# EAGLE design teenseyBreakoutFin (EAGLE 8.3.2)
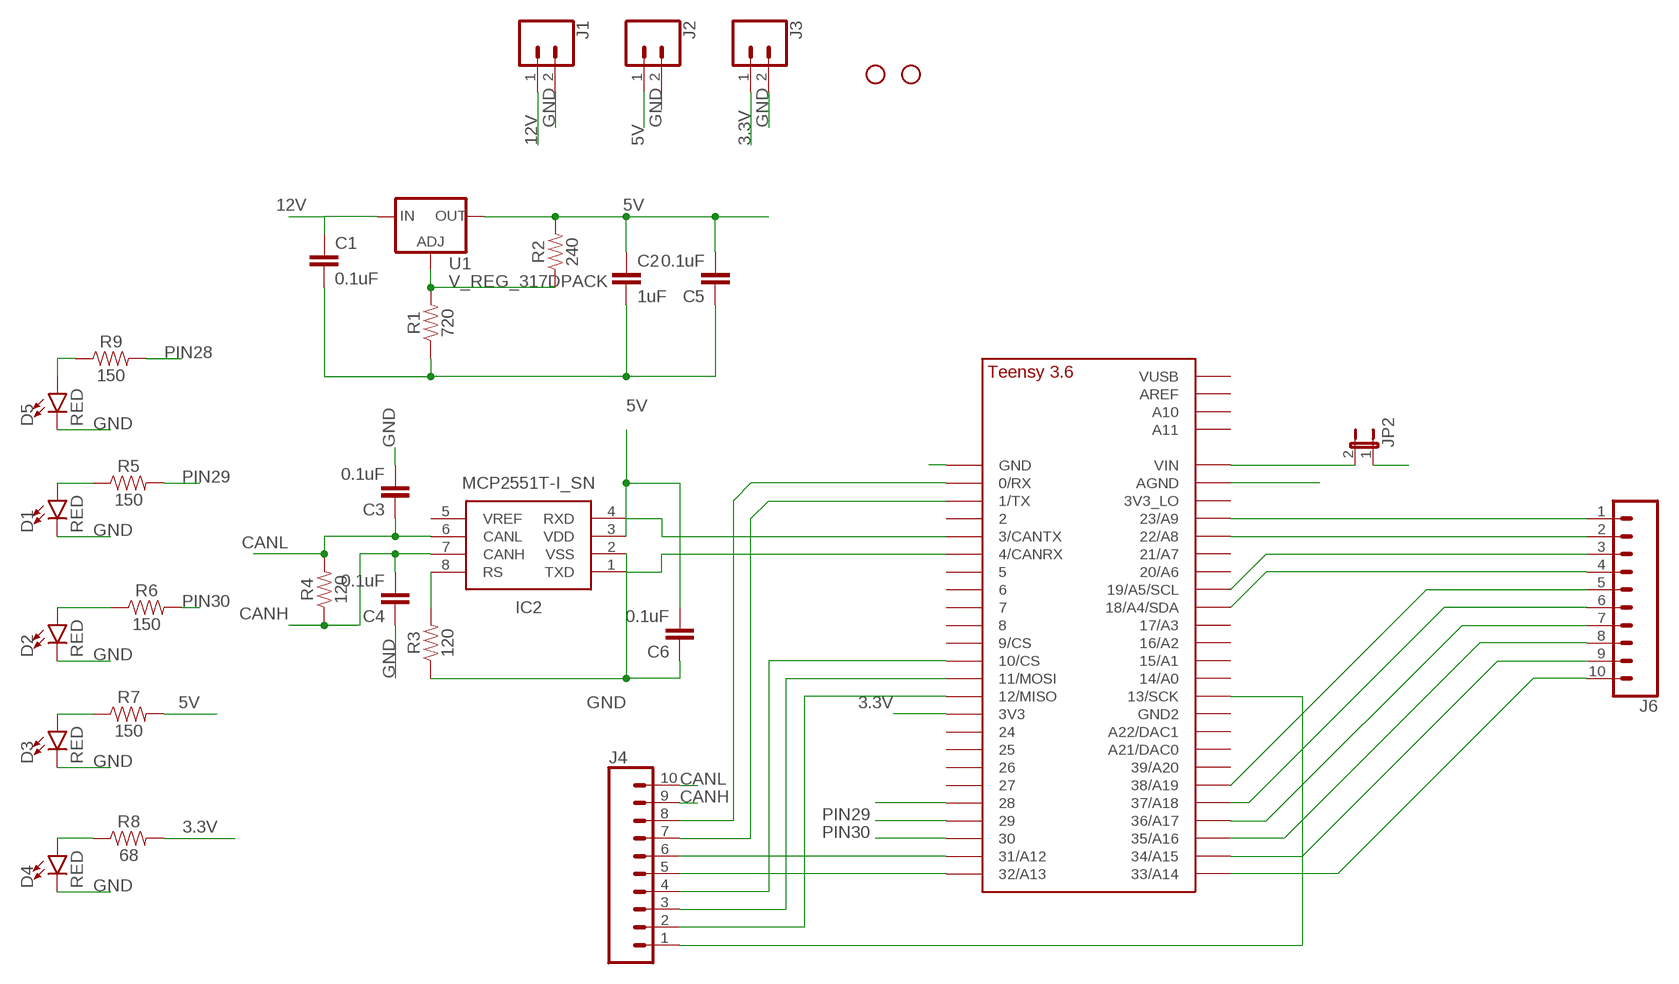
[diagram p0: schematic, sheet 1]

## Parts
C1  0.1uF  0.1UF-0402-16V-10%  [0402]
C2  1uF  0.22UF-0603-25V-10%  [0603]
C3  0.1uF  0.1UF-0603-25V-(+80/-20%)  [0603]
C4  0.1uF  0.1UF-0603-25V-(+80/-20%)  [0603]
C5  0.1uF  0.1UF-0603-25V-(+80/-20%)  [0603]
C6  0.1uF  0.1UF-0603-25V-(+80/-20%)  [0603]
D1  RED  LED-RED0603  [LED-0603]
D2  RED  LED-RED0603  [LED-0603]
D3  RED  LED-RED0603  [LED-0603]
D4  RED  LED-RED0603  [LED-0603]
D5  RED  LED-RED0603  [LED-0603]
H2  STAND-OFF  [STAND-OFF]
IC2  MCP2551T-I_SN  [SOIC127P600X175-8N]
J1  CONN_023.5MM_LOCK  [SCREWTERMINAL-3.5MM-2_LOCK]
J2  CONN_023.5MM_LOCK  [SCREWTERMINAL-3.5MM-2_LOCK]
J3  CONN_023.5MM_LOCK  [SCREWTERMINAL-3.5MM-2_LOCK]
J4  CONN_10LOCK  [1X10_LOCK]
J6  CONN_10LOCK  [1X10_LOCK]
JP2  JP1E  [JP1]
R1  720  1.20KOHM-0603-1/10W-1%  [0603]
R2  240  1.20KOHM-0603-1/10W-1%  [0603]
R3  120  1.2MOHM-0603-1/10W-1%  [0603]
R4  120  10KOHM-HORIZ-1/4W-1%  [AXIAL-0.3]
R5  150  0.27OHM-0603-1/10W-1%  [0603]
R6  150  0.27OHM-0603-1/10W-1%  [0603]
R7  150  0.27OHM-0603-1/10W-1%  [0603]
R8  68  0.27OHM-0603-1/10W-1%  [0603]
R9  150  0.27OHM-0603-1/10W-1%  [0603]
SCREW_HOLE  STAND-OFF  [STAND-OFF]
U1  V_REG_317DPACK  [V-REG_DPACK]
U$1  TEENSY_3.5/3.6_BASIC  [TEENSY_3.5/3.6_BASIC]

## Nets
3.3V: J3.1 R8.2 U$1.3V3
5V: C2.1 C5.2 C6.2 IC2.3(VDD) J2.1 JP2.1 R2.2 R7.2 U1.4(OUT)
12V: C1.1 J1.1 U1.3(IN)
CANH: C4.2 IC2.7(CANH) J4.9 R4.P$1
CANL: C3.1 IC2.6(CANL) J4.10 R4.P$2
GND: C1.2 C2.2 C3.2 C4.1 C5.1 C6.1 D1.C D2.C D3.C D4.C D5.C IC2.2(VSS) J1.2 J2.2 J3.2 R1.1 R3.1 U$1.AGND U$1.GND
N$1: IC2.1(TXD) U$1.4/CANRX
N$2: J4.8 U$1.0/RX
N$3: R1.2 R2.1 U1.1(ADJ)
N$4: J4.7 U$1.1/TX
N$5: J4.6 U$1.31/A12
N$6: J4.5 U$1.32/A13
N$7: J4.4 U$1.10/CS
N$8: IC2.4(RXD) U$1.3/CANTX
N$9: J4.1 U$1.13/SCK
N$10: IC2.8(RS) R3.2
N$11: J4.3 U$1.11/MOSI
N$12: J4.2 U$1.12/MISO
N$13: J6.1 U$1.23/A9
N$14: J6.2 U$1.22/A8
N$15: J6.3 U$1.19/A5/SCL
N$16: J6.4 U$1.18/A4/SDA
N$17: J6.5 U$1.38/A19
N$18: J6.6 U$1.37/A18
N$19: J6.7 U$1.36/A17
N$20: J6.8 U$1.35/A16
N$21: J6.9 U$1.34/A15
N$22: J6.10 U$1.33/A14
N$24: D1.A R5.1
N$25: D5.A R9.1
N$26: D2.A R6.1
N$28: D3.A R7.1
N$30: D4.A R8.1
PIN28: R9.2 U$1.28
PIN29: R5.2 U$1.29
PIN30: R6.2 U$1.30
VIN: JP2.2 U$1.VIN
Unconnected: IC2.5(VREF) U$1.2 U$1.3V3_LO U$1.5 U$1.6 U$1.7 U$1.8 U$1.9/CS U$1.14/A0 U$1.15/A1 U$1.16/A2 U$1.17/A3 U$1.20/A6 U$1.21/A7 U$1.21/DAC0(A21/DAC0) U$1.24 U$1.25 U$1.26 U$1.27 U$1.39/A20 U$1.A10 U$1.A11 U$1.A22/DAC1 U$1.AREF U$1.GND2 U$1.VUSB

## Library data of the parts
C1 = SparkFun-Capacitors:0.1UF: 0.1µF ceramic capacitors A capacitor is a passive two-terminal electrical component used to store electrical energy temporarily in an electric field.; PROD_ID: CAP-12416
C2 = SparkFun-Capacitors:0.22UF: 0.22µF ceramic capacitors A capacitor is a passive two-terminal electrical component used to store electrical energy temporarily in an electric field.; PROD_ID: CAP-07822; VALUE: 0.22uF
C3-C6 = SparkFun-Capacitors:0.1UF: 0.1µF ceramic capacitors A capacitor is a passive two-terminal electrical component used to store electrical energy temporarily in an electric field.; PROD_ID: CAP-00810
D1-D5 = SparkFun-LED:LED-RED: Red SMD LED Used in manufacturing of most products at SparkFun Packages: 0603 - SMD 0603 package [Product Link] <http://docs.avagotech.com/docs/AV02-0551EN> 0603 SMART - SMD 0603 SMART package ( more efficient and expensive)[Product Link] <http://www.osram-os.com/Graphics/XPic2/00077099_0.pdf> 1206 - SMD1206 package [Product Link] <https://www.sparkfun.com/datasheets/DevTools/LilyPad/Q150OVS4.pdff> SparkFun Products: Pro Mini 328 -5V <https://www.sparkfun.com/products/821> RedBoard <https://www.sparkfun.com/products/12757> IOIO-OTG <https://www.sparkfun.com/products/13613>; PROD_ID: DIO-00819
H2 SCREW_HOLE = SparkFun-Hardware:STAND-OFF: Stand Off Drill holes for mechanically mounting via screws, standoffs, etc. Note: Use the keepout ring to avoid running the screw head into surrounding components. Variant Overviews STAND-OFF - Mechanical footprint for a #4 phillips button head screw. STAND-OFF-TIGHT - Mechanical footprint for a #4 phillips button head screw, Example SparkFun Products Screw - Phillips Head (1/4", 4-40, 10 pack) <https://www.sparkfun.com/products/10453> (PRT-10453) Screw - Phillips Head (1/2", 4-40, 10 pack) <https://www.sparkfun.com/products/10452> (PRT-10452) Screw - Phillips Head (3/4", 4-40, 10 pack) <https://www.sparkfun.com/products/10451> (PRT-10451) Screw - Phillips Head (1", 4-40, 10 pack) <https://www.sparkfun.com/products/10450> (PRT-10450)
IC2 = MCP2551T-I_SN:MCP2551T-I_SN: CAN Interface IC Hi Spd CAN Transceiv <https://componentsearchengine.com/Images/3/MCP2551T-I_SN.jpg> Source: Datasheet <http://docs-europe.electrocomponents.com/webdocs/1324/0900766b8132487b.pdf>; DESCRIPTION: CAN Interface IC Hi Spd CAN Transceiv; HEIGHT: 1.75mm; MANUFACTURER_NAME: Microchip; MANUFACTURER_PART_NUMBER: MCP2551T-I/SN; RS_PART_NUMBER: 8237897P; SUPPLIER_NAME: RS
J1-J3 = SparkFun-Connectors:CONN_02: Multi connection point. Often used as Generic Header-pin footprint for 0.1 inch spaced/style header connections On any of the 0.1 inch spaced packages, you can populate with these: Break Away Headers - Straight <https://www.sparkfun.com/products/116> (PRT-00116) Break Away Male Headers - Right Angle <https://www.sparkfun.com/products/553> (PRT-00553) Female Headers <https://www.sparkfun.com/products/115> (PRT-00115) Break Away Headers - Machine Pin <https://www.sparkfun.com/products/117> (PRT-00117) Break Away Female Headers - Swiss Machine Pin <https://www.sparkfun.com/products/743> (PRT-00743) For SCREWTERMINALS and SPRING TERMINALS visit here: Screw Terimnals on SparkFun.com <https://www.sparkfun.com/search/results?term=Screw+Terminals> (5mm/3.5mm/2.54mm spacing) This device is also useful as a general connection point to wire up your design to another part of your project. Our various solder wires solder well into these plated through hole pads. Hook-Up Wire - Assortment (Stranded, 22 AWG) <https://www.sparkfun.com/products/11375> (PRT-11375) Hook-Up Wire - Assortment (Solid Core, 22 AWG) <https://www.sparkfun.com/products/11367> (PRT-11367) View the entire wire category on our website here <https://www.sparkfun.com/categories/141> Special notes: Molex polarized connector foot print use with: PRT-08233 with associated crimp pins and housings. 2.54_SCREWTERM for use with PRT-10571. 3.5mm Screw Terminal footprints for PRT-08084 5mm Screw Terminal footprints for use with PRT-08432; PROD_ID: CONN-08399
J4 J6 = SparkFun-Connectors:CONN_10: Multi connection point. Often used as Generic Header-pin footprint for 0.1 inch spaced/style header connections On any of the 0.1 inch spaced packages, you can populate with these: Break Away Headers - Straight <https://www.sparkfun.com/products/116> (PRT-00116) Break Away Male Headers - Right Angle <https://www.sparkfun.com/products/553> (PRT-00553) Female Headers <https://www.sparkfun.com/products/115> (PRT-00115) Break Away Headers - Machine Pin <https://www.sparkfun.com/products/117> (PRT-00117) Break Away Female Headers - Swiss Machine Pin <https://www.sparkfun.com/products/743> (PRT-00743) Arduino Stackable Header - 10 Pin <https://www.sparkfun.com/products/11376> (PRT-11376) For SCREWTERMINALS and SPRING TERMINALS visit here: Screw Terimnals on SparkFun.com <https://www.sparkfun.com/search/results?term=Screw+Terminals> (5mm/3.5mm/2.54mm spacing) This device is also useful as a general connection point to wire up your design to another part of your project. Our various solder wires solder well into these plated through hole pads. Hook-Up Wire - Assortment (Stranded, 22 AWG) <https://www.sparkfun.com/products/11375> (PRT-11375) Hook-Up Wire - Assortment (Solid Core, 22 AWG) <https://www.sparkfun.com/products/11367> (PRT-11367) View the entire wire category on our website here <https://www.sparkfun.com/categories/141> Special notes: Molex polarized connector foot print use with SKU : PRT-08231 with associated crimp pins and housings. 1MM SMD Version SKU: PRT-10208 NOTES ON THE VARIANTS LOCK and LOCK_LONGPADS... This footprint was designed to help hold the alignment of a through-hole component (i.e. 6-pin header) while soldering it into place. You may notice that each hole has been shifted either up or down by 0.005 of an inch from it's more standard position (which is a perfectly straight line). This slight alteration caused the pins (the squares in the middle) to touch the edges of the holes. Because they are alternating, it causes a "brace" to hold the component in place. 0.005 has proven to be the perfect amount of "off-center" position when using our standard breakaway headers. Although looks a little odd when you look at the bare footprint, once you have a header in there, the alteration is very hard to notice. Also,if you push a header all the way into place, it is covered up entirely on the bottom side.
JP2 = jumper:JP1E: JUMPER
R1 R2 = SparkFun-Resistors:1.20KOHM: 1.20kΩ resistor A resistor is a passive two-terminal electrical component that implements electrical resistance as a circuit element. Resistors act to reduce current flow, and, at the same time, act to lower voltage levels within circuits. - Wikipedia; PROD_ID: RES-08413; VALUE: 1.20k
R3 = SparkFun-Resistors:1.2MOHM: 1.2MΩ resistor A resistor is a passive two-terminal electrical component that implements electrical resistance as a circuit element. Resistors act to reduce current flow, and, at the same time, act to lower voltage levels within circuits. - Wikipedia; PROD_ID: RES-10055; VALUE: 1.2M
R4 = SparkFun-Resistors:10KOHM: 10kΩ resistor A resistor is a passive two-terminal electrical component that implements electrical resistance as a circuit element. Resistors act to reduce current flow, and, at the same time, act to lower voltage levels within circuits. - Wikipedia; PROD_ID: RES-12183; VALUE: 10k
R5-R9 = SparkFun-Resistors:0.27OHM: 0.27Ω resistor A resistor is a passive two-terminal electrical component that implements electrical resistance as a circuit element. Resistors act to reduce current flow, and, at the same time, act to lower voltage levels within circuits. - Wikipedia; PROD_ID: RES-08787; VALUE: 0.27
U1 = SparkFun-IC-Power:V_REG_317: Voltage Regulator Standard LM317 adjustable voltage regulator. AOI (Adjust Output Input). Google 'LM317 Calculator' for easy to use app to get the two resistor values needed. 240/720 for 5V output. 240/390 for 3.3V output. Spark Fun Electronics SKU : COM-00527; PROD_ID: IC-09888
U$1 = Teensy356:TEENSY_3.5/3.6_BASIC

## Board
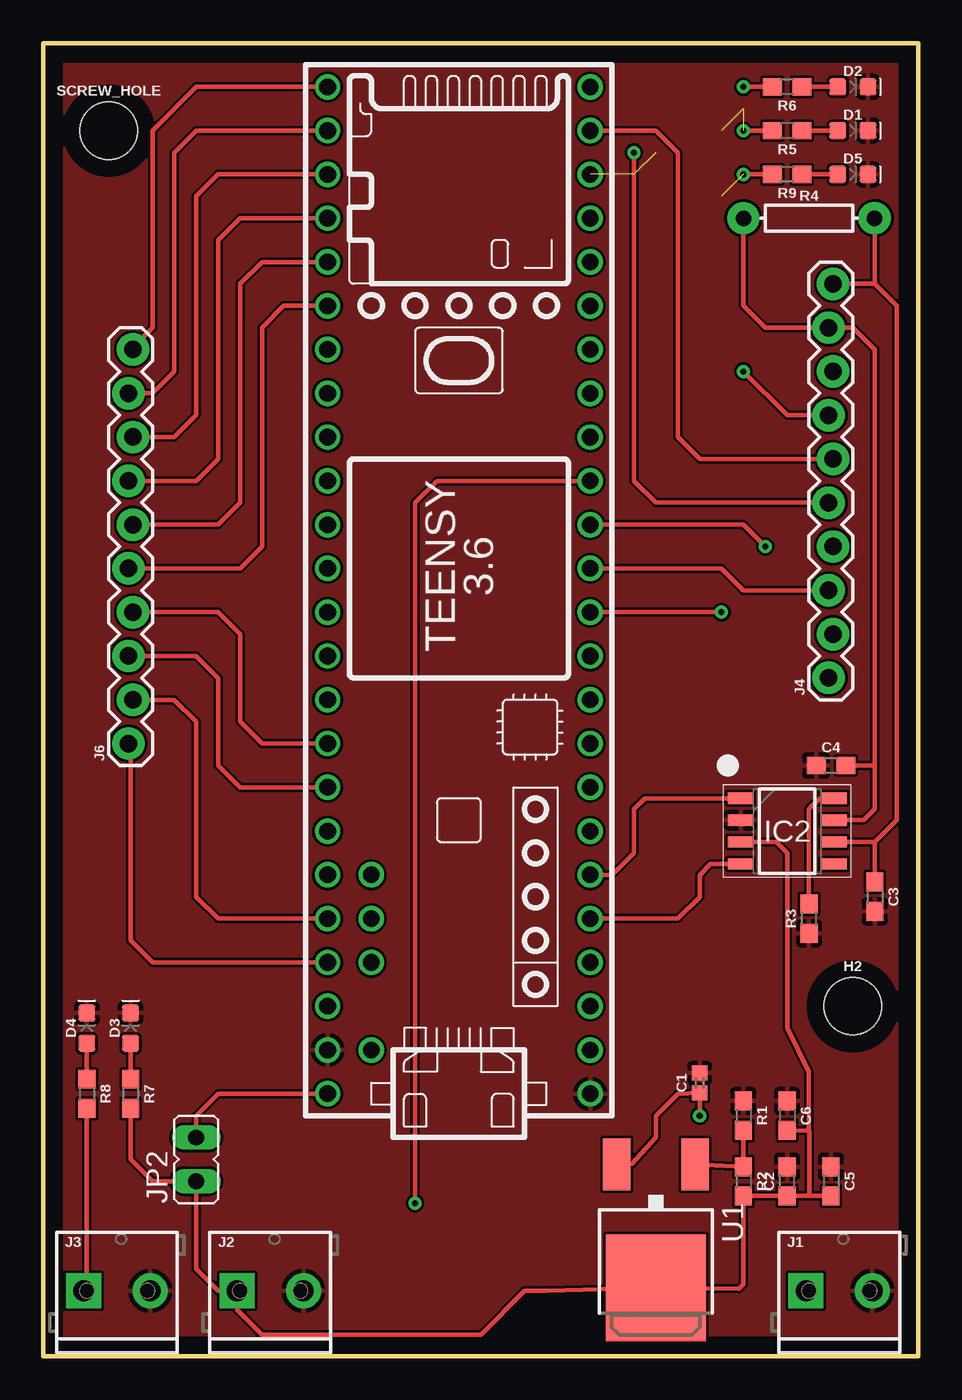
[diagram p1: board, top side]
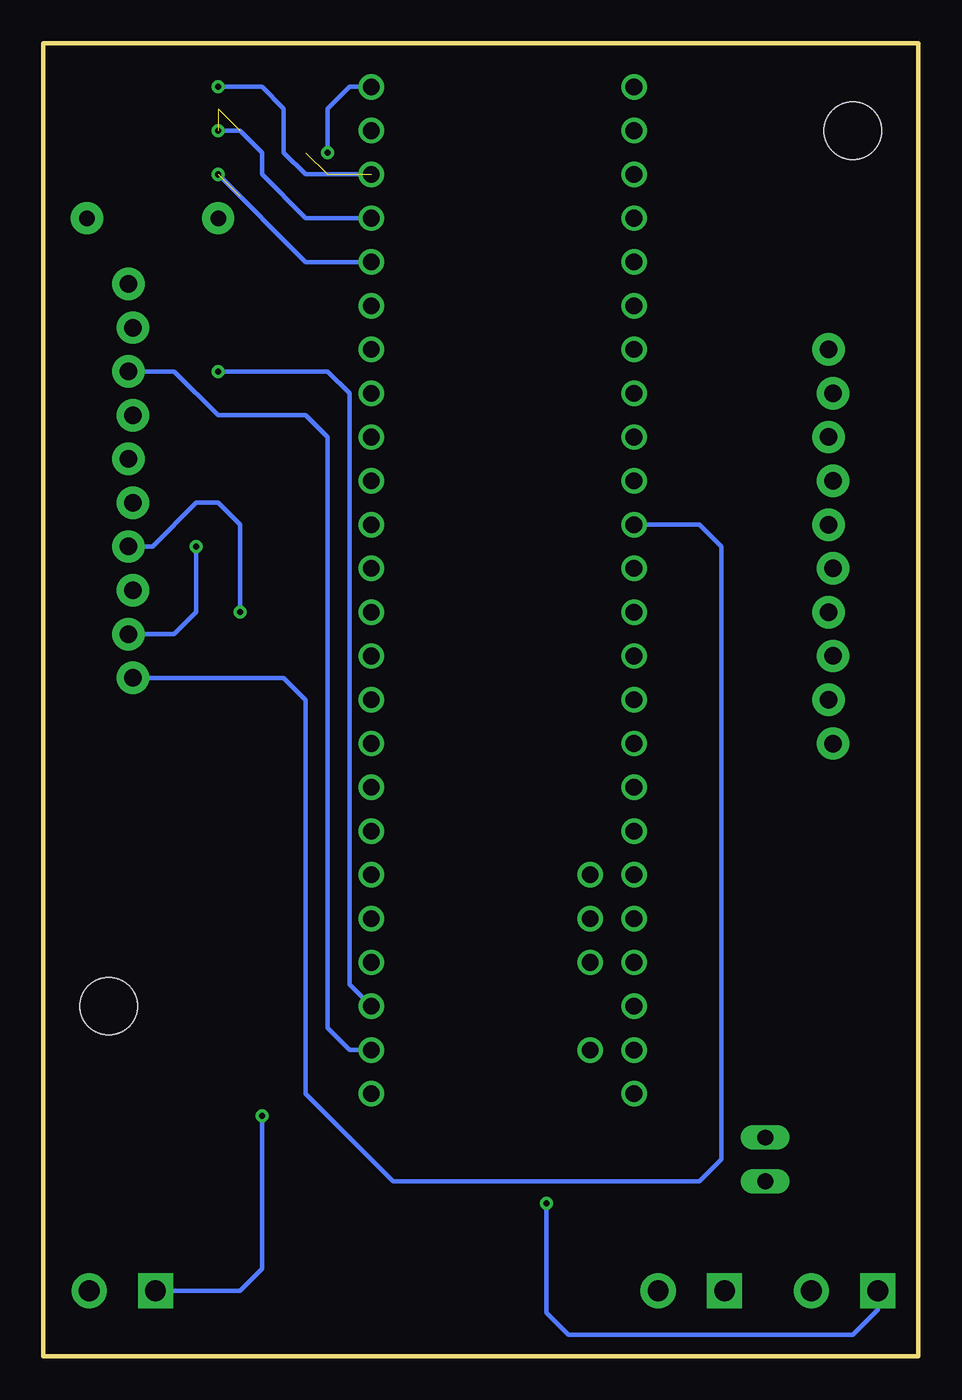
[diagram p2: board, bottom side, seen from below]

Size 50.8 x 76.2 mm. Coordinates in mm from the lower left corner, seen from the top.
Outline: 0,0 0,76.2 50.8,76.2 50.8,0 0,0
Copper layers (1*16): Top 0.035mm / dielectric 1.5mm / Bottom 0.035mm
Design rules "default": minimum track width 6mil, minimum drill 0.35mm, track to track 6mil, track to pad 6mil, pad to pad 6mil, via to via 6mil, smd to smd 6mil, copper to edge 40mil, drill to drill 6mil, minimum pad ring 10mil, minimum via ring 8mil, stop-mask expansion 4mil, vias tented up to drill 0mil, thermal gap 10mil

### Footprints (pad centres in the part's own frame; a part is rotated, then mirrored left to right if it is on the bottom)
0402 = smd 0.85 x 0.9: 1 -0.58,0; 2 0.58,0
0603 = smd 1.1 x 1: 1 -0.85,0; 2 0.85,0
LED-0603 = smd 1 x 1: A -0.877,0; C 0.877,0
STAND-OFF = hole 3.302: 0,0
SOIC127P600X175-8N = smd 1.5 x 0.65: 1 -2.7,1.905; 2 -2.7,0.635; 3 -2.7,-0.635; 4 -2.7,-1.905; 5 2.7,-1.905; 6 2.7,-0.635; 7 2.7,0.635; 8 2.7,1.905
SCREWTERMINAL-3.5MM-2_LOCK = drill 1.2 pad 2.032 square: 1 -0.178,0 | drill 1.2 pad 2.032: 2 3.678,0
1X10_LOCK = drill 1.016 pad 1.88: 1 0,0.127; 2 2.54,-0.127; 3 5.08,0.127; 4 7.62,-0.127; 5 10.16,0.127; 6 12.7,-0.127; 7 15.24,0.127; 8 17.78,-0.127; 9 20.32,0.127; 10 22.86,-0.127
JP1 = drill 0.914 long: 1 0,-1.27; 2 0,1.27
AXIAL-0.3 = drill 0.9 pad 1.88: P$1 -3.81,0; P$2 3.81,0
V-REG_DPACK = smd 1.6 x 3: 1 -2.28,-4.8; 3 2.28,-4.8 | smd 5.8 x 6.2: 4 0,2.38
TEENSY_3.5/3.6_BASIC = drill 0.965: 0/RX -25.4,-7.62; 1/TX -22.86,-7.62; 2 -20.32,-7.62; 3/CANTX -17.78,-7.62; 3V3 7.62,-7.62; 3V3_LO -22.86,7.62; 4/CANRX -15.24,-7.62; 5 -12.7,-7.62; 6 -10.16,-7.62; 7 -7.62,-7.62; 8 -5.08,-7.62; 9/CS -2.54,-7.62; 10/CS 0,-7.62; 11/MOSI 2.54,-7.62; 12/MISO 5.08,-7.62; 13/SCK 5.08,7.62; 14/A0 2.54,7.62; 15/A1 0,7.62; 16/A2 -2.54,7.62; 17/A3 -5.08,7.62; 18/A4/SDA -7.62,7.62; 19/A5/SCL -10.16,7.62; 20/A6 -12.7,7.62; 21/A7 -15.24,7.62; 21/DAC0 12.7,7.62; 22/A8 -17.78,7.62; 23/A9 -20.32,7.62; 24 10.16,-7.62; 25 12.7,-7.62; 26 15.24,-7.62; 27 17.78,-7.62; 28 20.32,-7.62; 29 22.86,-7.62; 30 25.4,-7.62; 31/A12 27.94,-7.62; 32/A13 30.48,-7.62; 33/A14 30.48,7.62; 34/A15 27.94,7.62; 35/A16 25.4,7.62; 36/A17 22.86,7.62; 37/A18 20.32,7.62; 38/A19 17.78,7.62; 39/A20 15.24,7.62; A10 -17.78,5.08; A11 -15.24,5.08; A22/DAC1 10.16,7.62; AGND -25.4,7.62; AREF -20.32,5.08; GND -27.94,-7.62; GND2 7.62,7.62; VIN -27.94,7.62; VUSB -25.4,5.08

### Placement (x,y rotation side)
C1  38.1,15.88 90 top
C2  43.18,10.16 90 top
C3  48.26,26.67 270 top
C4  45.72,34.29 0 top
C5  45.72,10.16 270 top
C6  43.18,13.97 270 top
D1  46.99,71.12 0 top
D2  46.99,73.66 0 top
D3  5.08,19.05 90 top
D4  2.54,19.05 90 top
D5  46.99,68.58 0 top
H2  46.99,20.32 0 top
IC2  43.18,30.48 0 top
J1  44.45,3.81 0 top
J2  11.43,3.81 0 top
J3  2.54,3.81 0 top
J4  45.72,39.37 90 top
J6  5.08,35.56 90 top
JP2  8.89,11.43 0 top
R1  40.64,13.97 270 top
R2  40.64,10.16 270 top
R3  44.45,25.4 90 top
R4  44.45,66.04 0 top
R5  43.18,71.12 180 top
R6  43.18,73.66 180 top
R7  5.08,15.24 270 top
R8  2.54,15.24 270 top
R9  43.18,68.58 180 top
SCREW_HOLE  3.81,71.12 0 top
U1  35.56,6.35 180 top
U$1  24.13,43.18 90 top

### Tracks (layer width: path | path; a pad name or v marks a point on that pad's centre or on a via)
3.3V  (via drill 0.35)
  Top 0.254: v21.59,8.89 21.59,49.53 22.86,50.8 U$1.3V3 | R8.2 2.54,3.99 J3.1
  Bottom 0.254: J3.1 2.36,2.72 3.81,1.27 20.32,1.27 21.59,2.54 v21.59,8.89
5V
  Top 0.254: IC2.3 42.55,29.84 43.18,29.21 43.18,19.05 44.45,16.51 44.45,13.08 44.46,13.1 | R7.2 5.08,11.43 6.35,10.16 JP2.1 8.89,5.08 10.16,3.81 J2.1 11.25,2.72 12.7,1.27 25.4,1.27 27.94,3.81 29.21,3.81 U1.4 40.39,3.94 40.64,4.19 R2.2 C2.1 44.45,9.31 | C6.2 44.46,13.1 | 44.45,9.31 C5.2 | 44.46,13.1 44.46,9.32 44.45,9.31
12V  (via drill 0.35)
  Top 0.254: U1.3 34.16,11.18 35.56,12.7 35.56,13.97 36.83,15.24 C1.1 v38.1,13.97
  Bottom 0.254: v38.1,13.97 38.1,5.08 39.37,3.81 J1.1
CANH
  Top 0.254: R4.P$1 40.64,60.96 41.91,59.69 J4.9 46.99,59.69 48.26,58.42 48.26,34.29 | IC2.7 47.62,31.11 48.26,31.75 48.26,34.29 | C4.2 48.26,34.29
CANL
  Top 0.254: 45.72,62.36 J4.10 48.26,62.23 | 48.26,62.23 49.53,60.96 49.53,31.11 48.26,29.84 | 48.26,29.84 IC2.6 | R4.P$2 48.26,62.23 | C3.1 48.26,29.84
GND
  pour Top: -12.7,92.71 -12.7,-40.64 130.81,-40.64 132.08,-31.75 111.76,88.9 91.44,91.44
N$1
  Top 0.254: IC2.1 34.92,32.38 34.29,31.75 34.29,29.21 33.02,27.94 U$1.4/CANRX
N$2
  Bottom 0.254: J4.8 43.18,57.15 40.64,54.61 35.56,54.61 34.29,53.34 34.29,19.05 33.02,17.78 U$1.0/RX
N$3
  Top 0.254: R1.2 R2.1 U1.1
N$4  (via drill 0.35)
  Top 0.254: J4.7 43.18,54.61 v40.64,57.15
  Bottom 0.254: v40.64,57.15 34.29,57.15 33.02,55.88 33.02,21.59 U$1.1/TX
N$5
  Top 0.254: U$1.31/A12 35.56,71.12 36.83,69.85 36.83,53.34 38.1,52.07 J4.6
N$6  (via drill 0.35)
  Top 0.254: v34.29,69.85 34.29,50.8 35.56,49.53 J4.5
  Bottom 0.254: U$1.32/A13 33.02,73.66 34.29,72.39 v34.29,69.85
N$7  (via drill 0.35)
  Top 0.254: v39.37,43.18 U$1.10/CS
  Bottom 0.254: J4.4 44.45,46.99 41.91,49.53 40.64,49.53 39.37,48.26 v39.37,43.18
N$8
  Top 0.254: IC2.4 38.73,28.57 38.1,27.94 38.1,26.67 36.83,25.4 U$1.3/CANTX
N$9
  Bottom 0.254: J4.1 36.83,39.37 35.56,38.1 35.56,15.24 30.48,10.16 12.7,10.16 11.43,11.43 11.43,46.99 12.7,48.26 U$1.13/SCK
N$10
  Top 0.254: IC2.8 45.09,32.38 44.45,31.75 R3.2
N$11
  Top 0.254: U$1.11/MOSI 39.37,45.72 40.64,44.45 J4.3
N$12  (via drill 0.35)
  Top 0.254: U$1.12/MISO 40.64,48.26 v41.91,46.99
  Bottom 0.254: v41.91,46.99 41.91,43.18 43.18,41.91 J4.2
N$13
  Top 0.254: U$1.23/A9 6.35,22.86 5.08,24.13 5.08,35.43 J6.1
N$14
  Top 0.254: J6.2 7.62,38.1 8.89,36.83 8.89,26.67 10.16,25.4 U$1.22/A8
N$15
  Top 0.254: J6.3 8.89,40.64 10.16,39.37 10.16,34.29 11.43,33.02 U$1.19/A5/SCL
N$16
  Top 0.254: J6.4 10.16,43.18 11.43,41.91 11.43,36.83 12.7,35.56 U$1.18/A4/SDA
N$17
  Top 0.254: U$1.38/A19 13.97,60.96 12.7,59.69 12.7,46.99 11.43,45.72 J6.5
N$18
  Top 0.254: U$1.37/A18 12.7,63.5 11.43,62.23 11.43,49.53 10.16,48.26 J6.6
N$19
  Top 0.254: U$1.36/A17 11.43,66.04 10.16,64.77 10.16,52.07 8.89,50.8 J6.7
N$20
  Top 0.254: U$1.35/A16 10.16,68.58 8.89,67.31 8.89,54.61 7.62,53.34 J6.8
N$21
  Top 0.254: U$1.34/A15 8.89,71.12 7.62,69.85 7.62,57.15 6.35,55.88 J6.9
N$22
  Top 0.254: U$1.33/A14 8.89,73.66 6.35,71.12 6.35,59.69 5.21,58.55 J6.10
N$24
  Top 0.254: D1.A R5.1
N$25
  Top 0.254: D5.A R9.1
N$26
  Top 0.254: D2.A R6.1
N$28
  Top 0.254: R7.1 D3.A
N$30
  Top 0.254: D4.A R8.1
PIN28  (via drill 0.35)  (2 unrouted)
  Top 0.254: R9.2 v40.64,68.58
  Bottom 0.254: U$1.28 35.56,63.5 v40.64,68.58
PIN29  (via drill 0.35)  (2 unrouted)
  Top 0.254: v40.64,71.12 R5.2
  Bottom 0.254: U$1.29 35.56,66.04 38.1,68.58 38.1,69.85 39.37,71.12 v40.64,71.12
PIN30  (via drill 0.35)  (2 unrouted)
  Top 0.254: R6.2 v40.64,73.66
  Bottom 0.254: v40.64,73.66 38.1,73.66 36.83,72.39 36.83,69.85 35.56,68.58 U$1.30
VIN
  Top 0.254: U$1.VIN 10.16,15.24 8.89,13.97 JP2.2